# Altium schematic sheet Testbench__PCB.SchDoc
size A4; SheetNumber: 1; SheetTotal: 5
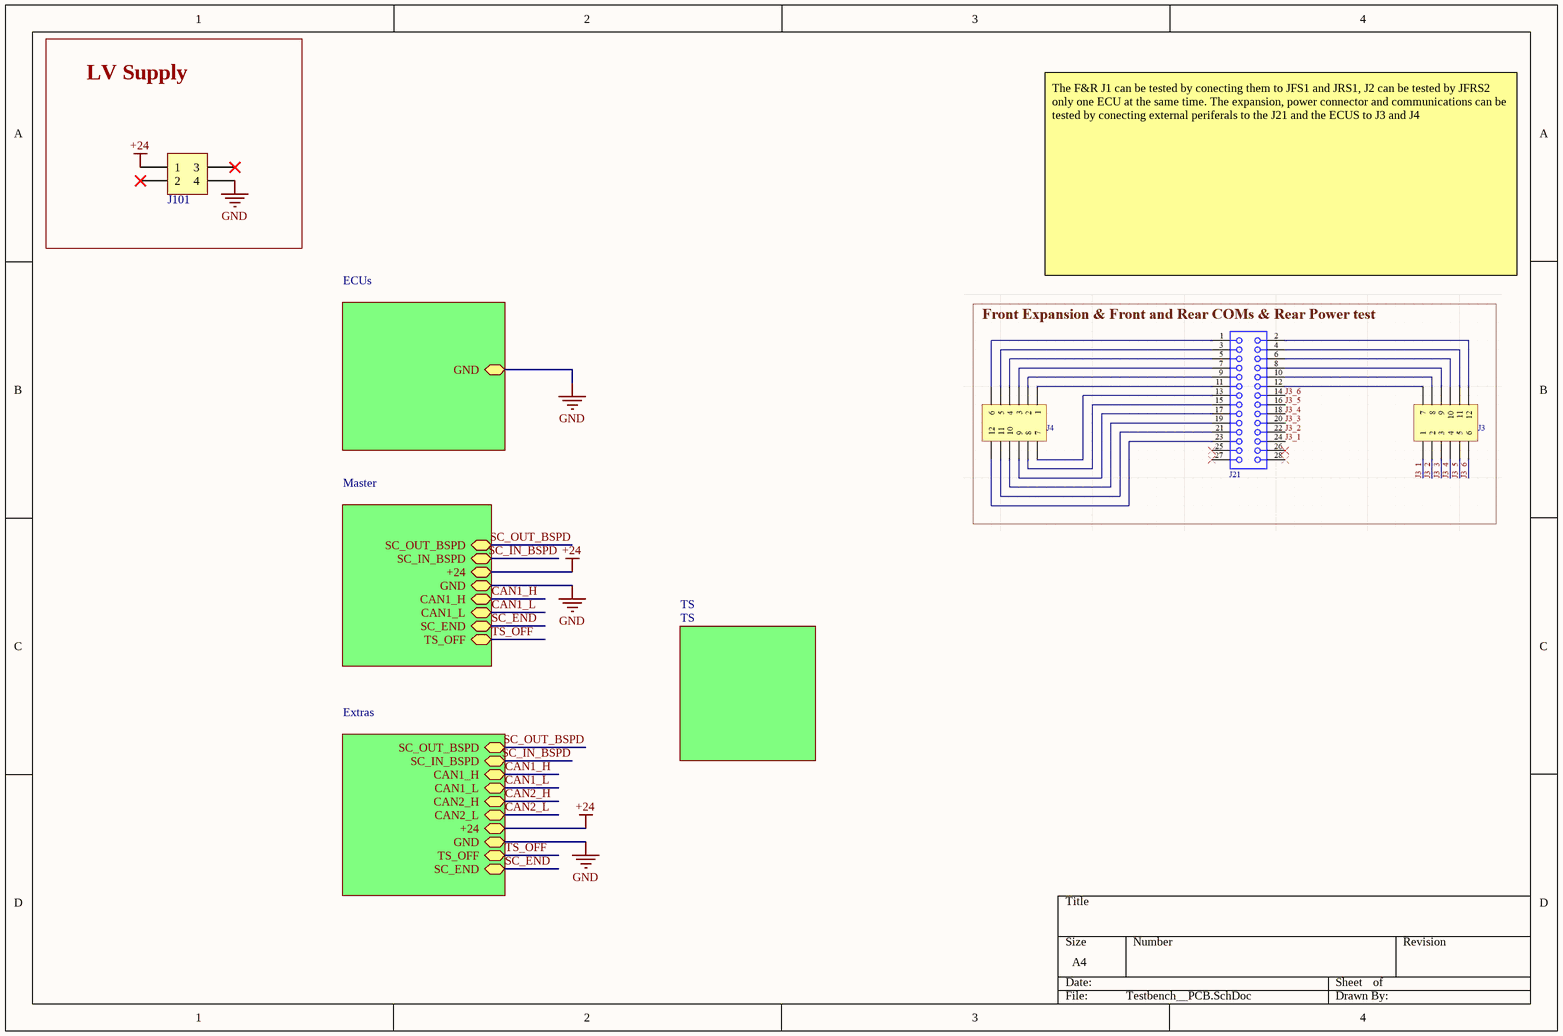
[diagram p0: Testbench__PCB.SchDoc]

## Parts
J101  430450412  [J_MicroFit_2x2_v]  (value not drawn)

## Blocks framed on the sheet
LV Supply: J101

## Sub-sheets
ECUs = ECUs: GND (bidir)
Extras = Extras: CAN1_H (bidir), CAN1_L (bidir), CAN2_H (bidir), CAN2_L (bidir), +24 (bidir), GND (bidir), TS_OFF (bidir), SC_END (bidir), SC_OUT_BSPD (bidir), SC_IN_BSPD (bidir)
Master = Master: SC_OUT_BSPD (bidir), SC_IN_BSPD (bidir), +24 (bidir), GND (bidir), CAN1_H (bidir), CAN1_L (bidir), SC_END (bidir), TS_OFF (bidir)
TS = TS: no entries

## Nets
+24: J101.1 ; sheet Master/+24, sheet Extras/+24
GND: J101.4 ; sheet ECUs/GND, sheet Master/GND, sheet Extras/GND
CAN1_H: sheet Master/CAN1_H, sheet Extras/CAN1_H
CAN1_L: sheet Master/CAN1_L, sheet Extras/CAN1_L
CAN2_H: sheet Extras/CAN2_H
CAN2_L: sheet Extras/CAN2_L
SC_END: sheet Master/SC_END, sheet Extras/SC_END
SC_IN_BSPD: sheet Master/SC_IN_BSPD, sheet Extras/SC_IN_BSPD
SC_OUT_BSPD: sheet Master/SC_OUT_BSPD, sheet Extras/SC_OUT_BSPD
TS_OFF: sheet Master/TS_OFF, sheet Extras/TS_OFF

Not connected (* = marked no-connect by the designer): J101 2* 3*

## Notes on the sheet
- The F&R J1 can be tested by conecting them to JFS1 and JRS1, J2 can be tested by JFRS2 only one ECU at the same time. The expansion, power connector and communications can be tested by conecting external periferals to the J21 and the ECUS to J3 and J4

## Library data of the parts
J101 = J_MicroFit_2x2: Header 2 Row Vertical Polarizing Peg 4 Pin Tin Plate SMT/Glow Wire Kinked Leads; Manufacturer 1: Molex; Manufacturer Part Number 1: 43045-0412; .Creator: DR; Supplier 1: Arrow Electronics; RoHS: Yes; Category: Headers and Wire Housings; Stock 1: 54122; Pricing 1: 1=1,24720, 10=1,02970, 80=0,85390, 2232=0,63810, 6696=0,59030, 11160=0,55550 (USD); ComponentLink1URL: https://datasheet.ciiva.com/19462/883368-19462265.pdf?src-supplier=Jameco; ComponentLink1Description: https://datasheet.ciiva.com/19462/883368-19462265.pdf?src-supplier=Jameco; ComponentLink2URL: https://datasheet.ciiva.com/5158/0430450412-pcb-headers-142874-5158187.pdf?src-supplier=Mouser; ComponentLink2Description: https://datasheet.ciiva.com/5158/0430450412-pcb-headers-142874-5158187.pdf?src-supplier=Mouser; ComponentLink3URL: https://datasheet.ciiva.com/30095/176640430450412-pcb-headers-30095929.pdf?src-supplier=Onlinecomponents.com; ComponentLink3Description: https://datasheet.ciiva.com/30095/176640430450412-pcb-headers-30095929.pdf?src-supplier=Onlinecomponents.com; ComponentLink4URL: https://datasheet.ciiva.com/11747/0900766b800bd7d2-11747137.pdf?src-supplier=RSComponents; ComponentLink4Description: https://datasheet.ciiva.com/11747/0900766b800bd7d2-11747137.pdf?src-supplier=RSComponents; ComponentLink5URL: https://datasheet.ciiva.com/26916/getdatasheetpartid-253008-26916516.pdf?src-supplier=Verical; ComponentLink5Description: https://datasheet.ciiva.com/26916/getdatasheetpartid-253008-26916516.pdf?src-supplier=Verical; ComponentLink6URL: https://datasheet.ciiva.com/22637/1928349-22637530.pdf?src-supplier=Element14; ComponentLink6Description: https://datasheet.ciiva.com/22637/1928349-22637530.pdf?src-supplier=Element14; ComponentLink7URL: https://datasheet.ciiva.com/9468/0430450412-pcb-headers-9468485.pdf?src-supplier=Avnet; ComponentLink7Description: https://datasheet.ciiva.com/9468/0430450412-pcb-headers-9468485.pdf?src-supplier=Avnet; Supplier Part Number 1: 43045-0412